# Altium schematic sheet CONNECTIVITY.SchDoc
size A3; Organization: Altium Limited; Address1: L3, 12a Rodborough Rd; Address2: Frenchs Forest; Address3: NSW; Address4: Australia 2086; DocumentNumber: 5; SheetNumber: 5; SheetTotal: 5
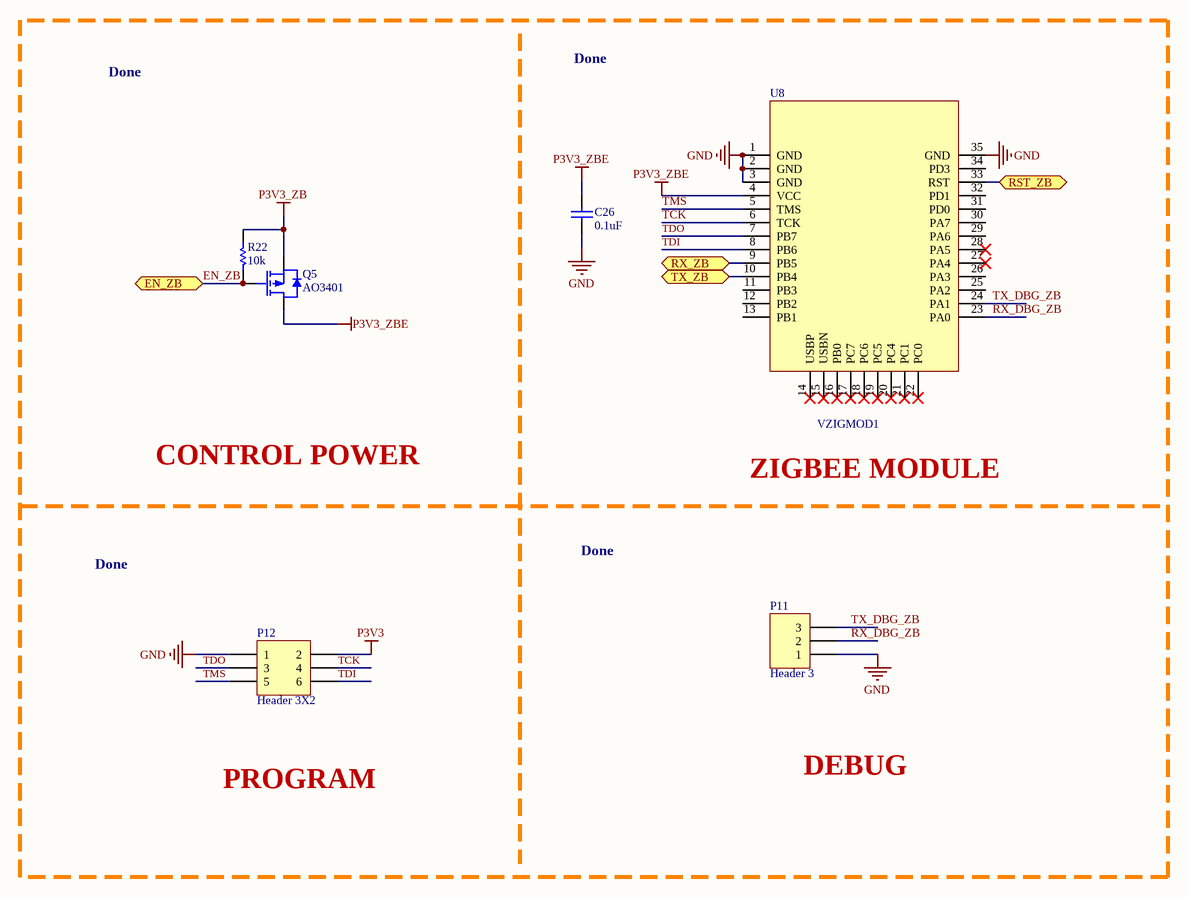
[diagram p0: CONNECTIVITY.SchDoc]

## Parts
C26  0.1uF  [C0402M]
P11  Header 3  [HDR1X3]
P12  Header 3X2  [HDR2X3]
Q5  AO3401  [SOT23-3N]
R22  10k  [R0603M]
U8  VZIGMOD1  [VZIGMOD2]

## Ports
EN_ZB, RST_ZB, RX_ZB, TX_ZB

## Nets
GND: C26.1 P11.1 P12.1 U8.1(GND) U8.2(GND) U8.3(GND) U8.35(GND)
P3V3: P12.2
P3V3_ZB: Q5.2(S) R22.2
P3V3_ZBE: C26.2 Q5.3(D) U8.4(VCC)
EN_ZB: Q5.1(G) R22.1 ; port EN_ZB
RST_ZB: U8.33(RST) ; port RST_ZB
RX_DBG_ZB: P11.2 U8.23(PA0)
RX_ZB: U8.9(PB5) ; port RX_ZB
TCK: P12.4 U8.6(TCK)
TDI: P12.6 U8.8(PB6)
TDO: P12.3 U8.7(PB7)
TMS: P12.5 U8.5(TMS)
TX_DBG_ZB: P11.3 U8.24(PA1)
TX_ZB: U8.10(PB4) ; port TX_ZB

Not connected (* = marked no-connect by the designer): U8 11(PB3) 12(PB2) 13(PB1) 14(USBP)* 15(USBN)* 16(PB0)* 17(PC7)* 18(PC6)* 19(PC5)* 20(PC4)* 21(PC1)* 22(PC0)* 25(PA2) 26(PA3) 27(PA4)* 28(PA5)* 29(PA6) 30(PA7) 31(PD0) 32(PD1) 34(PD3)

## Notes on the sheet
- Done
- CONTROL POWER
- ZIGBEE MODULE
- PROGRAM
- DEBUG
- Title
- Size:
- Date:
- A3
- Number:
- Time:
- Revision:
- Sheet
- of
- File:

## Library data of the parts
C26 = CAP0.1u0402: CAP CER 0.1UF 16V X7R 0402; Manufacturer: Samsung Electro-Mechanics; Manufacturer Part Number: CL05B104KO5NNNC; Tolerance: ±10%; Notification: Current market demand for these product types have resulted in fluctuating and extending lead times. Lead times may differ.; Module: Connectivity; Supplier 1: Digi-Key; Supplier Part Number 1: 1276-1001-6-ND; RoHS: RoHS Compliant; Category: Capacitors; Stock 1: 100000; Pricing 1: 1=0.1, 10=0.03, 100=0.0134, 500=0.00958, 1000=0.00753, 2500=0.00684, 5000=0.0063 (USD); Packaging: Digi-Reel®; Part Status: Active; Voltage - Rated: 16V; Temperature Coefficient: X7R; Operating Temperature: -55°C ~ 125°C; Features: -; Ratings: -; Applications: General Purpose; Mounting Type: Surface Mount, MLCC; Package / Case: 0402 (1005 Metric); Size / Dimension: 0.039" L x 0.020" W (1.00mm x 0.50mm); Height - Seated (Max): -; Thickness (Max): 0.022" (0.55mm); Lead Spacing: -; Lead Style: -; ComponentLink1URL: http://www.samsungsem.com/kr/support/product-search/mlcc/CL05B104KO5NNNC.jsp; ComponentLink1Description: http://www.samsungsem.com/kr/support/product-search/mlcc/CL05B104KO5NNNC.jsp
P11 = Header 3: Header, 3-Pin; LatestRevisionDate: 17-Jul-2002; LatestRevisionNote: Re-released for DXP Platform.; Publisher: Altium Limited
P12 = Header 3X2: Header, 3-Pin, Dual row; LatestRevisionDate: 17-Jul-2002; LatestRevisionNote: Re-released for DXP Platform.; Publisher: Altium Limited
Q5 = MOSFET-P1: P-Channel MOSFET
R22 = RES10k0603: RES SMD 10K OHM 1% 1/10W 0603; Manufacturer: Panasonic Electronic Components; Manufacturer Part Number: ERJ-3EKF1002V; Power (Watts): 0.1W, 1/10W; Temperature Coefficient: ±100ppm/°C; Supplier 1: Digi-Key; RoHS: RoHS Compliant; Category: Resistors; Stock 1: 0; Pricing 1: 1=0.1, 10=0.021, 100=0.0087, 1000=0.00389, 2500=0.00338 (USD); Packaging: Digi-Reel®; Part Status: Active; Resistance (Ohms): 10k; Tolerance: ±1%; Composition: Thick Film; Features: Automotive AEC-Q200; Operating Temperature: -55°C ~ 155°C; Package / Case: 0603 (1608 Metric); Supplier Device Package: 0603; Size / Dimension: 0.063" L x 0.031" W (1.60mm x 0.80mm); Height - Seated (Max): 0.022" (0.55mm); Failure Rate: -; ComponentLink1URL: https://industrial.panasonic.com/cdbs/www-data/pdf/RDA0000/AOA0000C298.pdf; ComponentLink1Description: https://industrial.panasonic.com/cdbs/www-data/pdf/RDA0000/AOA0000C298.pdf; Supplier Part Number 1: P10.0KHDKR-ND
U8 = VZIGMOD2: VNPT ZIGBEE MODULE V1 - No-PA; Manufacturer: VNPT-Technology; Utilized IC / Part: CC2538; Catgory: RF/IF and RFID; Sensitivity: -99dBm; Data Rate: 250kbps; Frequency: 2.4GHz; Power - Output: 7dBm; Serial Interfaces: I²C, SPI, UART; Antenna Type: Integrated, PCB, External; Voltage - Supply: 1.85 V ~ 3.8 V; Module: Connectivity; Manufacturer Part Number: VZIGMOD1; Mounting Type: Surface Mount; Operating Temperature: -40°C ~ 85°C; Package / Case: 33-SMD Module